# EAGLE design main (EAGLE 6.1)
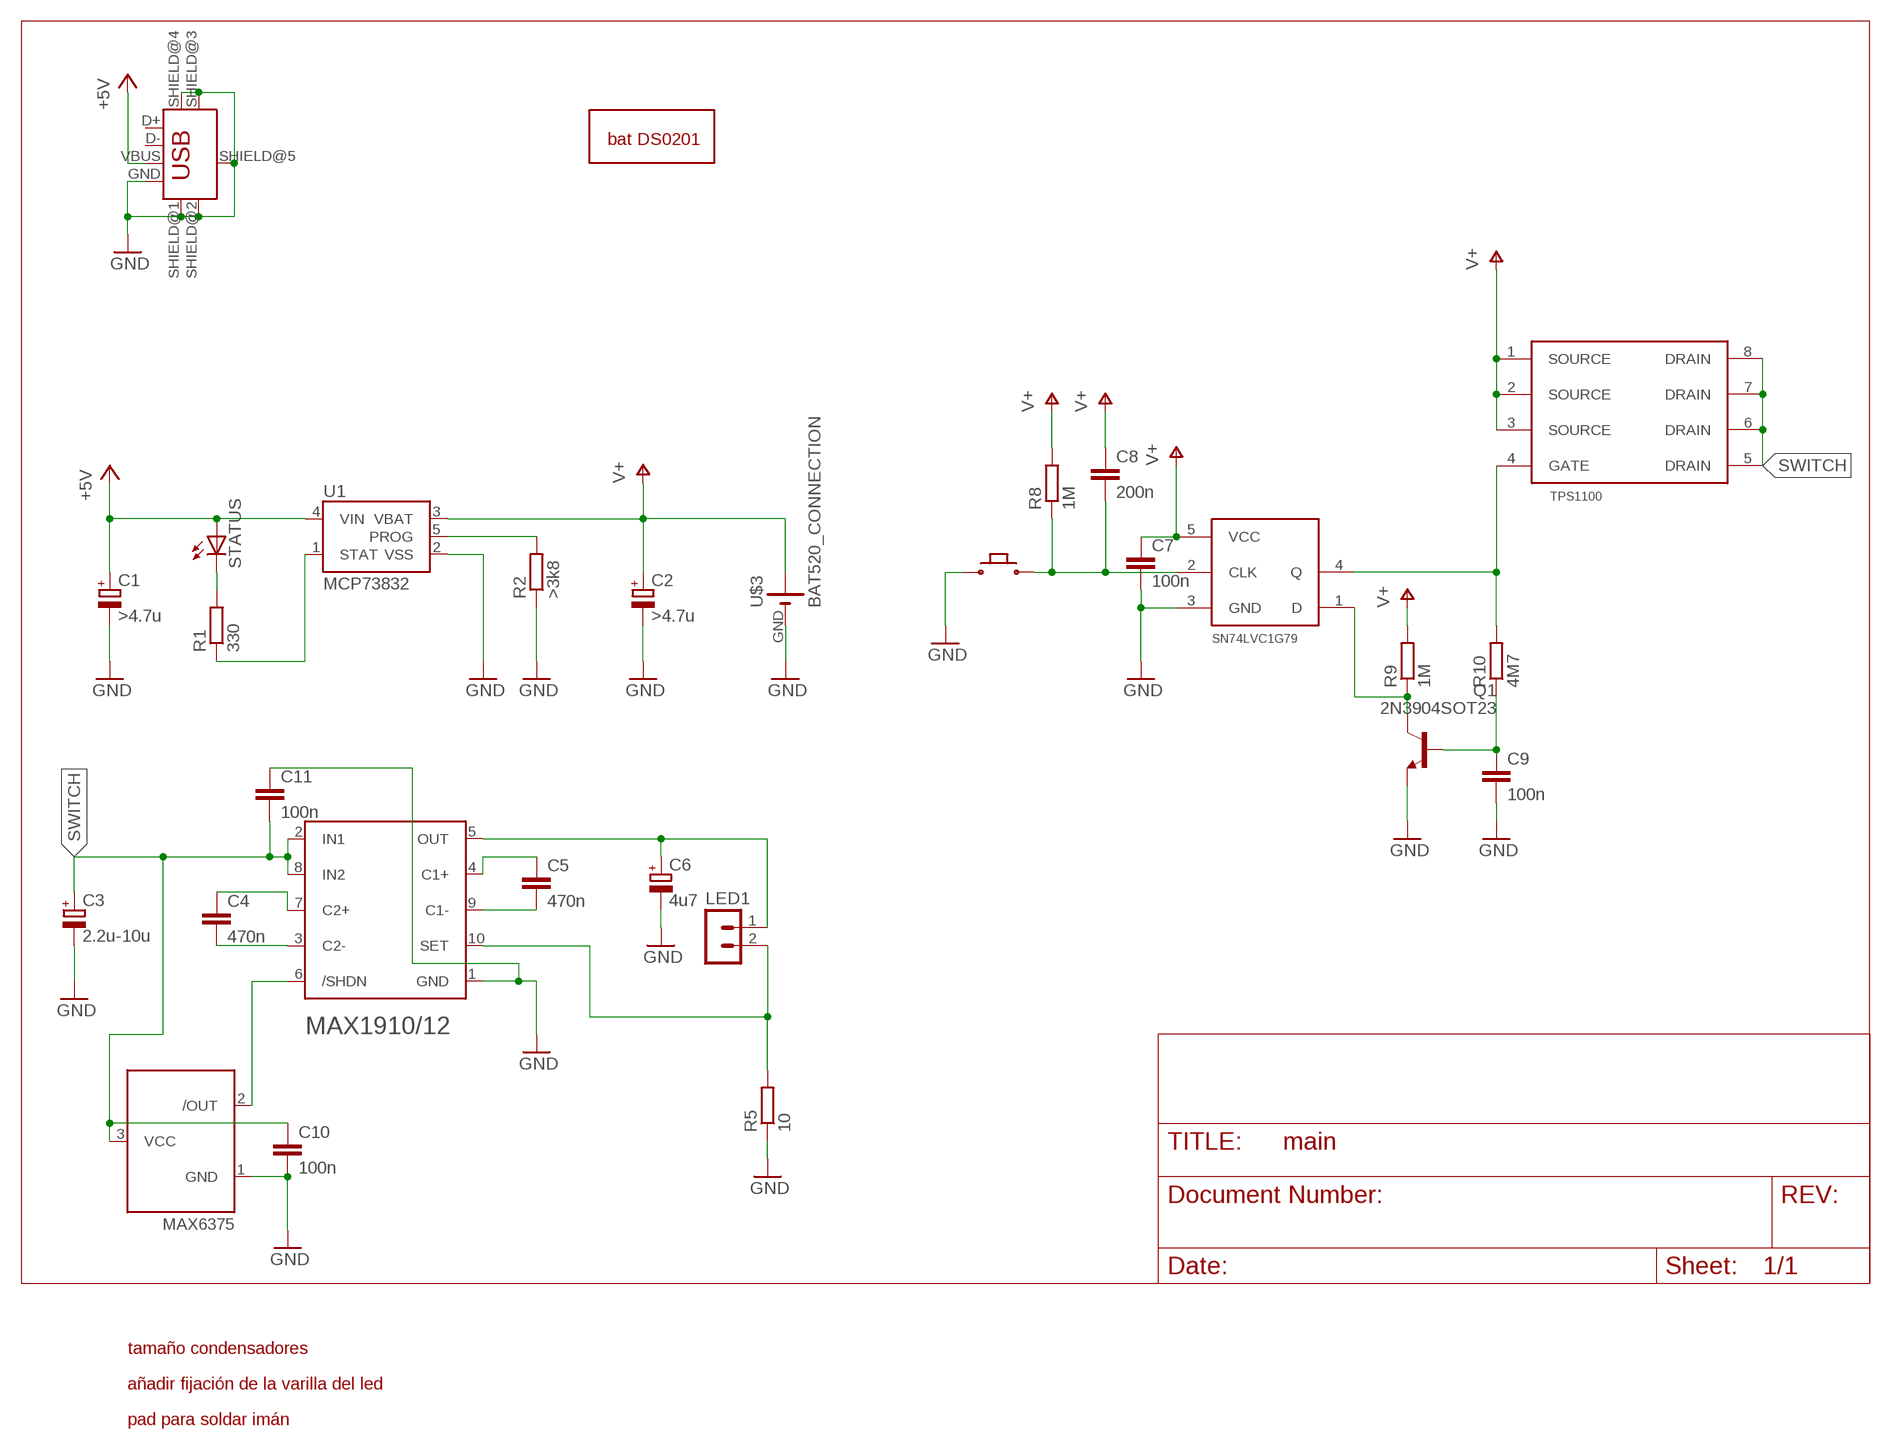
[diagram p0: schematic, sheet 1]

## Parts
C1  >4.7u  CPOL-EUSMCB  [SMC_B]
C2  >4.7u  CPOL-EUSMCB  [SMC_B]
C3  2.2u-10u  CPOL-EUSMCB  [SMC_B]
C4  470n  C-EUC1206  [C1206]
C5  470n  C-EUC1206  [C1206]
C6  4u7  CPOL-EUSMCB  [SMC_B]
C7  100n  C-EUC1206  [C1206]
C8  200n  C-EUC1206  [C1206]
C9  100n  C-EUC1206  [C1206]
C10  100n  C-EUC1206  [C1206]
C11  100n  C-EUC1206  [C1206]
LED1  MA02-1  [MA02-1W]
Q1  2N3904SOT23  [SOT23]
R1  330  R-EU_R1206  [R1206]
R2  >3k8  R-EU_R1206  [R1206]
R5  10  R-EU_R1206  [R1206]
R8  1M  R-EU_R0805  [R0805]
R9  1M  R-EU_R0805  [R0805]
R10  4M7  R-EU_R1206  [R1206]
STATUS  LEDCHIPLED_1206  [CHIPLED_1206]
U1  MCP73832  [SOT23-5]
U$1  MAX1910/12  [UMAX/USOP_10L]
U$2  MAX6375  [SC70-3-W]
U$3  BAT520_CONNECTION  [BAT520_CONN_SMD]
U$4  BAT_DS0201_PACKAGE  [BAT_DS0201]
U$5  MICROUSB_B  [USB-MICROB]
U$6  MICROBUTTON_0072  [MICROBUTTON]
U$7  SN74LVC1G79  [SOT23-5]
U$8  TPS1100  [SO08]

## Nets
+5V: C1.+ STATUS.A U1.4(VIN) U$5.VBUS
GND: C1.- C2.- C3.- C6.- C7.2 C9.2 C10.2 C11.1 Q1.2(E) R2.1 R5.1 U1.2(VSS) U$1.1(GND) U$2.1(GND) U$3.GND(-) U$5.GND U$5.SHIELD@1(SHIELD) U$5.SHIELD@2(SHIELD) U$5.SHIELD@3(SHIELD) U$5.SHIELD@4(SHIELD) U$5.SHIELD@5(SHIELD) U$6.P$2 U$7.3(GND)
N$1: Q1.3(C) R9.1 U$7.1(D)
N$2: R1.2 STATUS.C
N$3: R2.2 U1.5(PROG)
N$4: R1.1 U1.1(STAT)
N$5: C4.2 U$1.3(C2-)
N$6: C4.1 U$1.7(C2+)
N$7: C5.2 U$1.9(C1-)
N$8: C5.1 U$1.4(C1+)
N$12: LED1.2 R5.2 U$1.10(SET)
N$14: C6.+ LED1.1 U$1.5(OUT)
N$15: U$1.6(/SHDN) U$2.2(/OUT)
N$16: C8.2 R8.1 U$6.P$1 U$7.2(CLK)
N$18: C9.1 Q1.1(B) R10.1
N$19: R10.2 U$7.4(Q) U$8.4(GATE)
SWITCH: C3.+ C10.1 C11.2 U$1.2(IN1) U$1.8(IN2) U$2.3(VCC) U$8.5(DRAIN) U$8.6(DRAIN) U$8.7(DRAIN) U$8.8(DRAIN)
V+: C2.+ C7.1 C8.1 R8.2 R9.2 U1.3(VBAT) U$3.VCC(+) U$7.5(VCC) U$8.1(SOURCE) U$8.2(SOURCE) U$8.3(SOURCE)
Unconnected: U$5.D+ U$5.D-

## Notes on the sheet
- tamaño condensadores
- añadir fijación de la varilla del led
- pad para soldar imán

## Library data of the parts
C1-C3 C6 = rcl:CPOL-EU: POLARIZED CAPACITOR, European symbol
C4 C5 C7-C11 = rcl:C-EU: CAPACITOR, European symbol
LED1 = dan:MA02-1
Q1 = dan:2N3904: NPN Transistor
R1 R2 R5 R8-R10 = rcl:R-EU_: RESISTOR, European symbol
STATUS = led:LED: LED OSRAM: - CHIPLED LG R971, LG N971, LY N971, LG Q971, LY Q971, LO R971, LY R971 LH N974, LH R974 LS Q976, LO Q976, LY Q976 LO Q996 - Hyper CHIPLED LW Q18S LB Q993, LB Q99A, LB R99A - SideLED LS A670, LO A670, LY A670, LG A670, LP A670 LB A673, LV A673, LT A673, LW A673 LH A674 LY A675 LS A676, LA A676, LO A676, LY A676, LW A676 LS A679, LY A679, LG A679 - Hyper Micro SIDELED® LS Y876, LA Y876, LO Y876, LY Y876 LT Y87S - SmartLED LW L88C, LW L88S LB L89C, LB L89S, LG L890 LS L89K, LO L89K, LY L89K LS L896, LA L896, LO L896, LY L896 - TOPLED LS T670, LO T670, LY T670, LG T670, LP T670 LSG T670, LSP T670, LSY T670, LOP T670, LYG T670 LG T671, LOG T671, LSG T671 LB T673, LV T673, LT T673, LW T673 LH T674 LS T676, LA T676, LO T676, LY T676, LB T676, LH T676, LSB T676, LW T676 LB T67C, LV T67C, LT T67C, LS T67K, LO T67K, LY T67K, LW E67C LS E67B, LA E67B, LO E67B, LY E67B, LB E67C, LV E67C, LT E67C LW T67C LS T679, LY T679, LG T679 LS T770, LO T770, LY T770, LG T770, LP T770 LB T773, LV T773, LT T773, LW T773 LH T774 LS E675, LA E675, LY E675, LS T675 LS T776, LA T776, LO T776, LY T776, LB T776 LHGB T686 LT T68C, LB T68C - Hyper Mini TOPLED® LB M676 - Mini TOPLED Santana® LG M470 LS M47K, LO M47K, LY M47K Source: http://www.osram.convergy.de LUXEON: - LUMILED® LXK2-PW12-R00, LXK2-PW12-S00, LXK2-PW14-U00, LXK2-PW14-V00 LXK2-PM12-R00, LXK2-PM12-S00, LXK2-PM14-U00 LXK2-PE12-Q00, LXK2-PE12-R00, LXK2-PE12-S00, LXK2-PE14-T00, LXK2-PE14-U00 LXK2-PB12-K00, LXK2-PB12-L00, LXK2-PB12-M00, LXK2-PB14-N00, LXK2-PB14-P00, LXK2-PB14-Q00 LXK2-PR12-L00, LXK2-PR12-M00, LXK2-PR14-Q00, LXK2-PR14-R00 LXK2-PD12-Q00, LXK2-PD12-R00, LXK2-PD12-S00 LXK2-PH12-R00, LXK2-PH12-S00 LXK2-PL12-P00, LXK2-PL12-Q00, LXK2-PL12-R00 Source: www.luxeon.com KINGBRIGHT: KA-3528ASYC Source: www.kingbright.com
U1 = dan:MCP73832: Microchip's MCP73832 Miniature single cell, fully integrated Li-Ion, Li-polymer charge management controller http://ww1.microchip.com/downloads/en/DeviceDoc/21984a.pdf
U$1 = dan:MAX1910/12: MAX1910/12 1.5X/2X High-Efficiency White LED Charge Pumps
U$2 = dan:MAX6375: MAX6375 3 pin, ultra-low-power sc70/sot23 voltage detectors
U$3 = dan:BAT520_CONNECTION
U$4 = dan:BAT_DS0201_PACKAGE
U$5 = dan:MICROUSB_B: USB+Shield USB connector with shield pins connectable
U$6 = dan:MICROBUTTON_0072
U$7 = dan:SN74LVC1G79
U$8 = dan:TPS1100

## Board
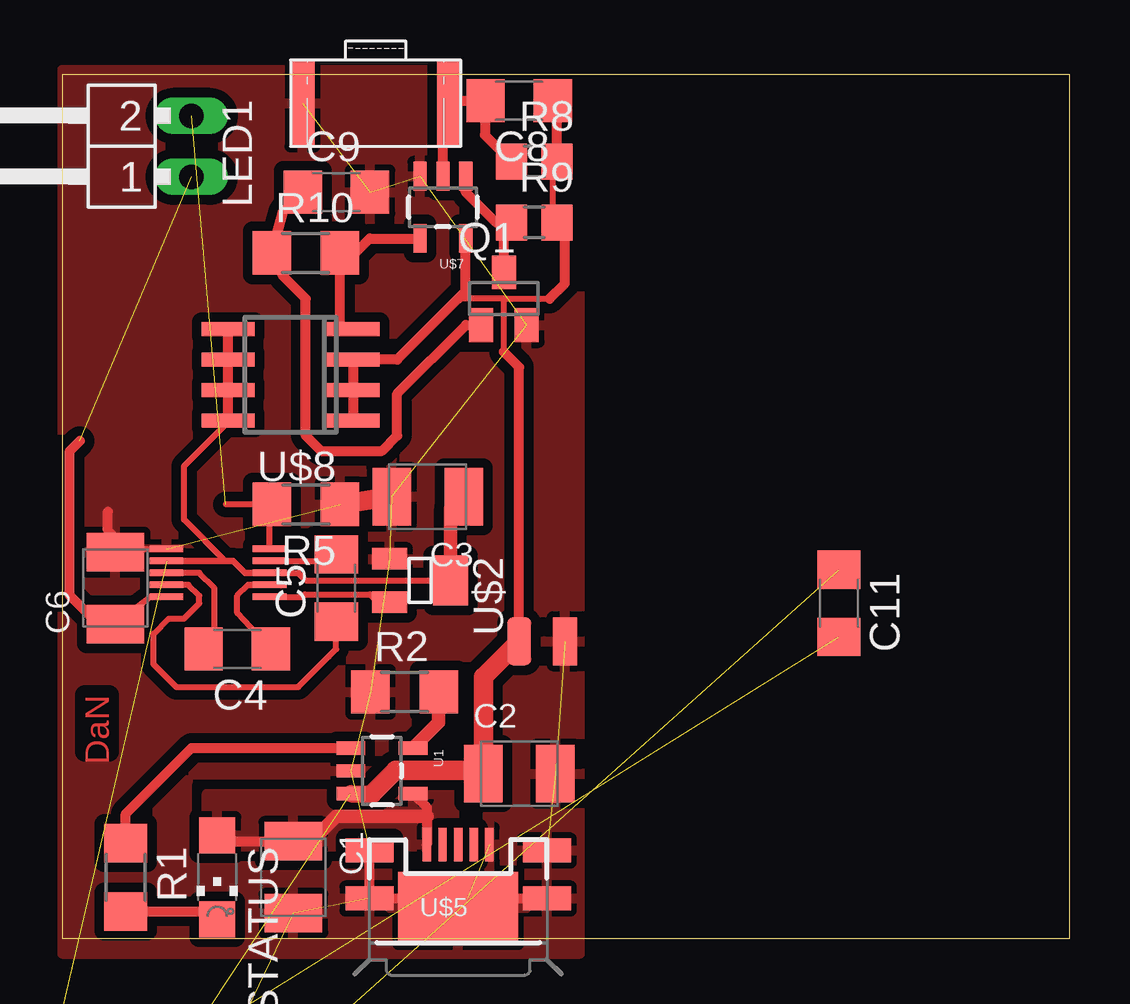
[diagram p1: board, top side]

Size 42 x 36 mm. Coordinates in mm from the lower left corner, seen from the top.
Outline: 0,0 42,0 42,36 0,36 0,0
Copper layers (1*16): Top 0.035mm / dielectric 1.5mm / Bottom 0.035mm
Design rules: minimum track width 10mil, minimum drill 24mil, track to track 16mil, track to pad 16mil, pad to pad 16mil, via to via 16mil, smd to smd 16mil, copper to edge 0mil, drill to drill 8mil, minimum pad ring 10mil, minimum via ring 8mil, stop-mask expansion 4mil, vias tented up to drill 0mil, thermal gap 10mil

### Footprints (pad centres in the part's own frame; a part is rotated, then mirrored left to right if it is on the bottom)
SMC_B = smd 1.6 x 2.4: + -1.5,0; - 1.5,0
C1206 = smd 1.6 x 1.8: 1 -1.4,0; 2 1.4,0
MA02-1W = drill 1.016 long: 1 -1.27,-2.54; 2 1.27,-2.54
SOT23 = smd 1 x 1.4: 1 -0.95,-1.1; 2 0.95,-1.1; 3 0,1.1
R1206 = smd 1.6 x 1.803: 1 -1.422,0; 2 1.422,0
R0805 = smd 1.3 x 1.5: 1 -0.95,0; 2 0.95,0
CHIPLED_1206 = smd 1.5 x 1.5: A 0,-1.75; C 0,1.75
SOT23-5 = smd 0.55 x 1.2: 1 -0.95,-1.3; 2 0,-1.3; 3 0.95,-1.3; 4 0.95,1.3; 5 -0.95,1.3
UMAX/USOP_10L = smd 1.4 x 0.28: 1 -2,1; 2 -2,0.5; 3 -2,0; 4 -2,-0.5; 5 -2,-1; 6 2.3,-1; 7 2.3,-0.5; 8 2.3,0; 9 2.3,0.5; 10 2.3,1
SC70-3-W = smd 0.9 x 1.45: 1 -0.9,-1.275; 2 0.9,-1.275 | smd 2.1 x 1.45: 3 0,1.275
BAT520_CONN_SMD = smd 1 x 2: GND 0.635,0; VCC -1.27,0
USB-MICROB = smd 0.35 x 1.4: D+ 0,2.65; D- -0.65,2.65; GND 1.3,2.65; ID 0.65,2.65; VBUS -1.3,2.65 | smd 2 x 1: SHIELD@1 -3.7,2.4; SHIELD@2 -3.7,0.4; SHIELD@4 3.7,0.4; SHIELD@5 3.7,2.4 | smd 5 x 3: SHIELD@3 0,0
MICROBUTTON = smd 1 x 3.6: P$1 6.6,1.8; P$2 0.5,1.8
SO08 = smd 0.6 x 2.2: 1 -1.905,-2.6; 2 -0.635,-2.6; 3 0.635,-2.6; 4 1.905,-2.6; 5 1.905,2.6; 6 0.635,2.6; 7 -0.635,2.6; 8 -1.905,2.6

### Placement (x,y rotation side)
C1  9.64,2.55 270 top
C2  19.06,6.87 0 top
C3  15.24,18.41 180 top
C4  7.3,12.06 180 top
C5  11.43,14.61 90 top
C6  2.22,14.61 90 top
C7  3.17,-9.53 0 top  (outside the outline)
C8  19.05,34.92 180 top
C9  11.43,31.11 0 top
C10  -1.27,-6.99 90 top  (outside the outline)
C11  32.38,13.97 270 top
LED1  2.86,33.02 90 top
Q1  18.41,26.67 0 top
R1  2.65,2.55 270 top
R2  14.28,10.28 0 top
R5  10.16,18.1 180 top
R8  19.68,32.38 0 top
R9  19.68,29.84 0 top
R10  10.16,28.57 0 top
STATUS  6.46,2.55 180 top
U1  13.34,6.99 270 top
U$1  6.35,15.24 0 top
U$2  14.92,14.92 270 top
U$3  20.32,12.38 0 top
U$4  13.97,-31.11 0 top  (outside the outline)
U$5  16.51,1.27 0 top
U$6  9.53,33.02 0 top
U$7  15.88,30.48 180 top
U$8  9.53,23.5 90 top

### Tracks (layer width: path | path; a pad name or v marks a point on that pad's centre or on a via)
+5V
  Top 0.406: 10.4,4.05 C1.+ 6.71,4.05 STATUS.A | U1.4 15.21,5.46 15.21,5.08 U$5.VBUS
  Top 0.559: 10.4,4.05 11.43,5.08 15.21,5.08
  pour Top: 17.14,3.81 6.03,3.81 6.03,6.03 13.34,6.03 13.32,7.04 17.14,6.99
GND  (17 unrouted)
  Top 0.254: 2.67,16.24 C6.- arc-90 2.67,16.24 | 2.67,16.24 U$1.1 | R5.1 12.22,18.73
  Top 0.406: U$5.SHIELD@4 16.91,1.67 U$5.SHIELD@3 16.11,1.67 U$5.SHIELD@2 U$5.SHIELD@1 | 2.67,16.24 1.91,17.01 1.91,17.78
  Top 0.813: R5.1 C3.-
  pour Top (rank 2): 0,36.2 0,-0.64 21.59,-0.64 21.59,36.2
N$1
  Top 0.406: U$7.1 16.82,31.12 18.1,29.84 R9.1 18.41,29.84 Q1.3
N$2
  Top 0.406: STATUS.C 6.14,1.13 R1.2
N$3
  Top 0.559: U1.5 15.7,9 R2.2
N$4
  Top 0.406: 2.54,4.09 R1.1 2.65,5.2 4.92,7.46 | 4.92,7.46 5.28,7.82 | U1.1 5.39,7.93 4.92,7.46
N$5
  Top 0.254: U$1.3 5.71,15.24 6.35,14.61 6.35,12.61 C4.2
N$6
  Top 0.254: 7.75,14.74 7.3,14.29 7.3,13.56 C4.1 8.89,12.06 8.26,12.7
  Top 0.279: 7.75,14.74 U$1.7
N$7
  Top 0.254: U$1.9 11.06,15.74 C5.2
N$8
  Top 0.254: U$1.4 5.26,14.74 5.71,14.29 5.71,13.97 5.08,13.34 4.45,13.34 3.81,12.7 3.81,11.43 4.76,10.48 9.84,10.48 11.11,11.75 11.43,12.06 C5.1
N$12  (1 unrouted)
  Top 0.254: 6.82,18.1 R5.2 8.65,18.01 U$1.10
N$14  (1 unrouted)
  Top 0.254: C6.+ 3.67,14.24 U$1.5
  Top 0.406: C6.+ 1.5,13.11 0.32,14.29 0.32,20.32 0.74,20.74
N$15
  Top 0.254: 13.11,14.24 U$2.2 13.15,14.02 12.82,14.35 10.13,14.35 10.02,14.24 U$1.6
N$16
  Top 0.406: R8.1 17.63,33.49 17.63,34.9 C8.2 16.23,34.92 U$6.P$1 15.88,34.82 U$7.2
N$18
  Top 0.406: Q1.1 16.83,25.57 13.97,22.71 13.97,20.95 13.34,20.32 10.79,20.32 10.16,20.95 10.16,26.67 9.21,27.62 R10.1 9.21,30.3 C9.1
N$19
  Top 0.406: 12.7,25.4 U$8.4 11.58,25.4 R10.2 12.22,28.57 12.82,29.18 U$7.4
SWITCH  (2 unrouted)
  Top 0.254: U$8.8 6.92,21.53 5.08,19.68 5.08,17.46 6.8,15.74 6.99,15.74 | U$1.8 9.84,15.24 10.16,14.92 U$2.3
  Top 0.279: U$1.2 6.99,15.74 7.12,15.74 7.62,15.24 U$1.8
  Top 0.406: U$8.8 U$8.7 U$8.6 U$8.5
  Top 0.559: U$2.3 16.2,17.87 arc-90 C3.+
V+  (1 unrouted)
  Top 0.254: 20.47,29.68 20.47,29.84 20.47,32.22 R8.2 | 18.41,26.67 16.51,26.67 | 18.41,26.67 20.32,26.67 | 18.41,24.45 18.41,26.67
  Top 0.406: 20.47,34.9 C8.1 20.64,34.74 R8.2 | U$8.1 U$8.2 U$8.3 13.97,24.13 16.51,26.67 16.82,26.98 U$7.5 | 18.41,24.45 19.05,23.81 U$3.VCC | 20.32,26.67 20.95,27.3 20.95,29.21 20.64,29.53 R9.2
  Top 0.559: 16.95,7.01 17.09,6.87 C2.+ | R9.2 20.47,29.84
  Top 0.711: U1.3 12.92,6.04
  Top 0.813: U$3.VCC 17.56,10.89 C2.+ | 16.95,7.01 13.89,7.01 12.92,6.04

### Text on the board
Top: DaN